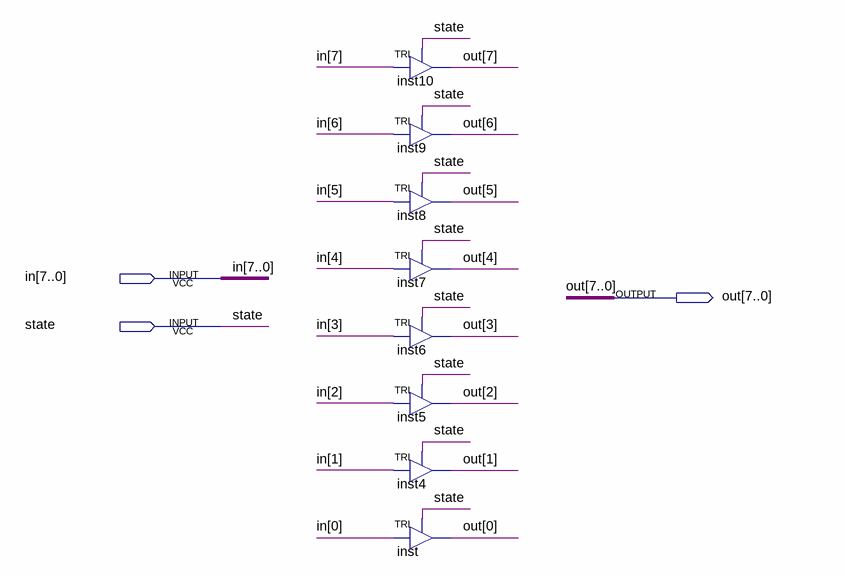
[diagram p0: schematic sheet]
// Quartus schematic tri_buffer8.bdf as structural Verilog: 8 symbols, 3 pins
module tri_buffer8 (
  input  [7:0] in,
  input  state,
  output [7:0] out
);

  TRI inst10 (.IN(in[7]), .OE(state), .OUT(out[7]));
  TRI inst9 (.IN(in[6]), .OE(state), .OUT(out[6]));
  TRI inst8 (.IN(in[5]), .OE(state), .OUT(out[5]));
  TRI inst7 (.IN(in[4]), .OE(state), .OUT(out[4]));
  TRI inst6 (.IN(in[3]), .OE(state), .OUT(out[3]));
  TRI inst5 (.IN(in[2]), .OE(state), .OUT(out[2]));
  TRI inst4 (.IN(in[1]), .OE(state), .OUT(out[1]));
  TRI inst (.IN(in[0]), .OE(state), .OUT(out[0]));
endmodule
